# Altium schematic sheet 3.3VRegulator.SchDoc
size A
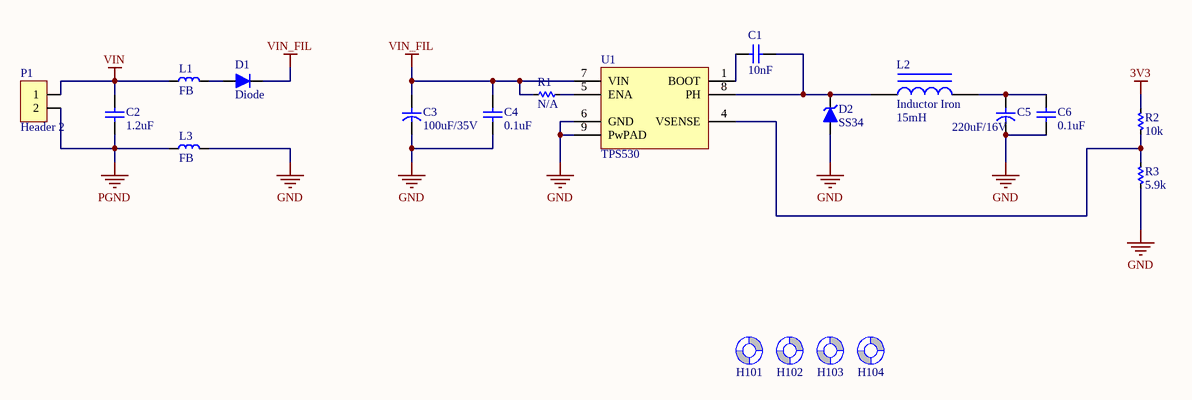
[diagram p0: 3.3VRegulator.SchDoc]

## Parts
C1  10nF  [C 0805]
C2  1.2uF  [C 0805]
C3  100uF/35V  [C SMD ALU (B)]
C4  0.1uF  [C 0805]
C5  220uF/16V  [C SMD ALU (B)]
C6  0.1uF  [C 0805]
D1  Diode  [SOD323]
D2  SS34  [DO-214AC (SMA)]
H101  Screw Hole  [SCREW/3.2/7.0/M]  (value not drawn)  (no BOM)
H102  Screw Hole  [SCREW/3.2/7.0/M]  (value not drawn)  (no BOM)
H103  Screw Hole  [SCREW/3.2/7.0/M]  (value not drawn)  (no BOM)
H104  Screw Hole  [SCREW/3.2/7.0/M]  (value not drawn)  (no BOM)
L1  FB  [L 0805 (2012)]
L2  Inductor Iron  value 15mH  [AXIAL-0.9]
L3  FB  [L 0805 (2012)]
P1  Header 2  [HDR/Header/2/BOX/RED]
R1  N/A  [RES-SMD-0201]
R2  10k  [RES-SMD-0201]
R3  5.9k  [RES-SMD-0201]
U1  TPS530  [SOIC-8 EP]

## Nets
3V3: R2.2
GND: C3.2 C4.2 C5.2 C6.2 D2.1(A) L3.2 R3.1 U1.6(GND) U1.9(PwPAD)
PGND: C2.2 L3.1 P1.2
VIN: C2.1 L1.1 P1.1
VIN_FIL: C3.1 C4.1 D1.2(K) R1.2 U1.7(VIN)
NetC1_1: C1.1 U1.1(BOOT)
NetC1_2: C1.2 D2.2(K) L2.1 U1.8(PH)
NetC5_1: C5.1 C6.1 L2.2
NetD1_1: D1.1(A) L1.2
NetR1_1: R1.1 U1.5(ENA)
NetR2_1: R2.1 R3.2 U1.4(VSENSE)

Not connected (* = marked no-connect by the designer): H101 1(Screw); H102 1(Screw); H103 1(Screw); H104 1(Screw)

## Library data of the parts
C1 C2 C4 C6 = Capacitor NP: Capacitor non-pol
C3 C5 = Capacitor: Capacitor pol
D1 = Diode: Default Diode
D2 = Diode Zener: Zener Diode
L1 L3 = Inductor
L2 = Inductor Iron: Magnetic-Core Inductor; Published: 24-Mar-1999; LatestRevisionDate: 17-Jul-2002; LatestRevisionNote: Re-released for DXP Platform.; PackageReference: AXIAL-0.9; Publisher: Altium Limited; PackageDescription: Axial Device, Thru-Hole; 2 Leads; 0.9 in Pin Spacing
P1 = Header 2: Header, 2-Pin
R1-R3 = Res-SMD: Resistor; Manufacturer: Generic Components; Class: Passive; Published: 08/06/2000; Publisher: Altium Hobart Technology Centre
U1 = TPS54xx: 3/5A, Wide input range, Step-down SWIFT DC-DC Converter
H101-H104 = Screw Hole: TYPE: NO-BOM; UNIT PRICE: 0